# EAGLE schematic Maxim_7219_LED_display_Adafruit_0.56_7_segment_v1_1 (EAGLE 6.5.0)
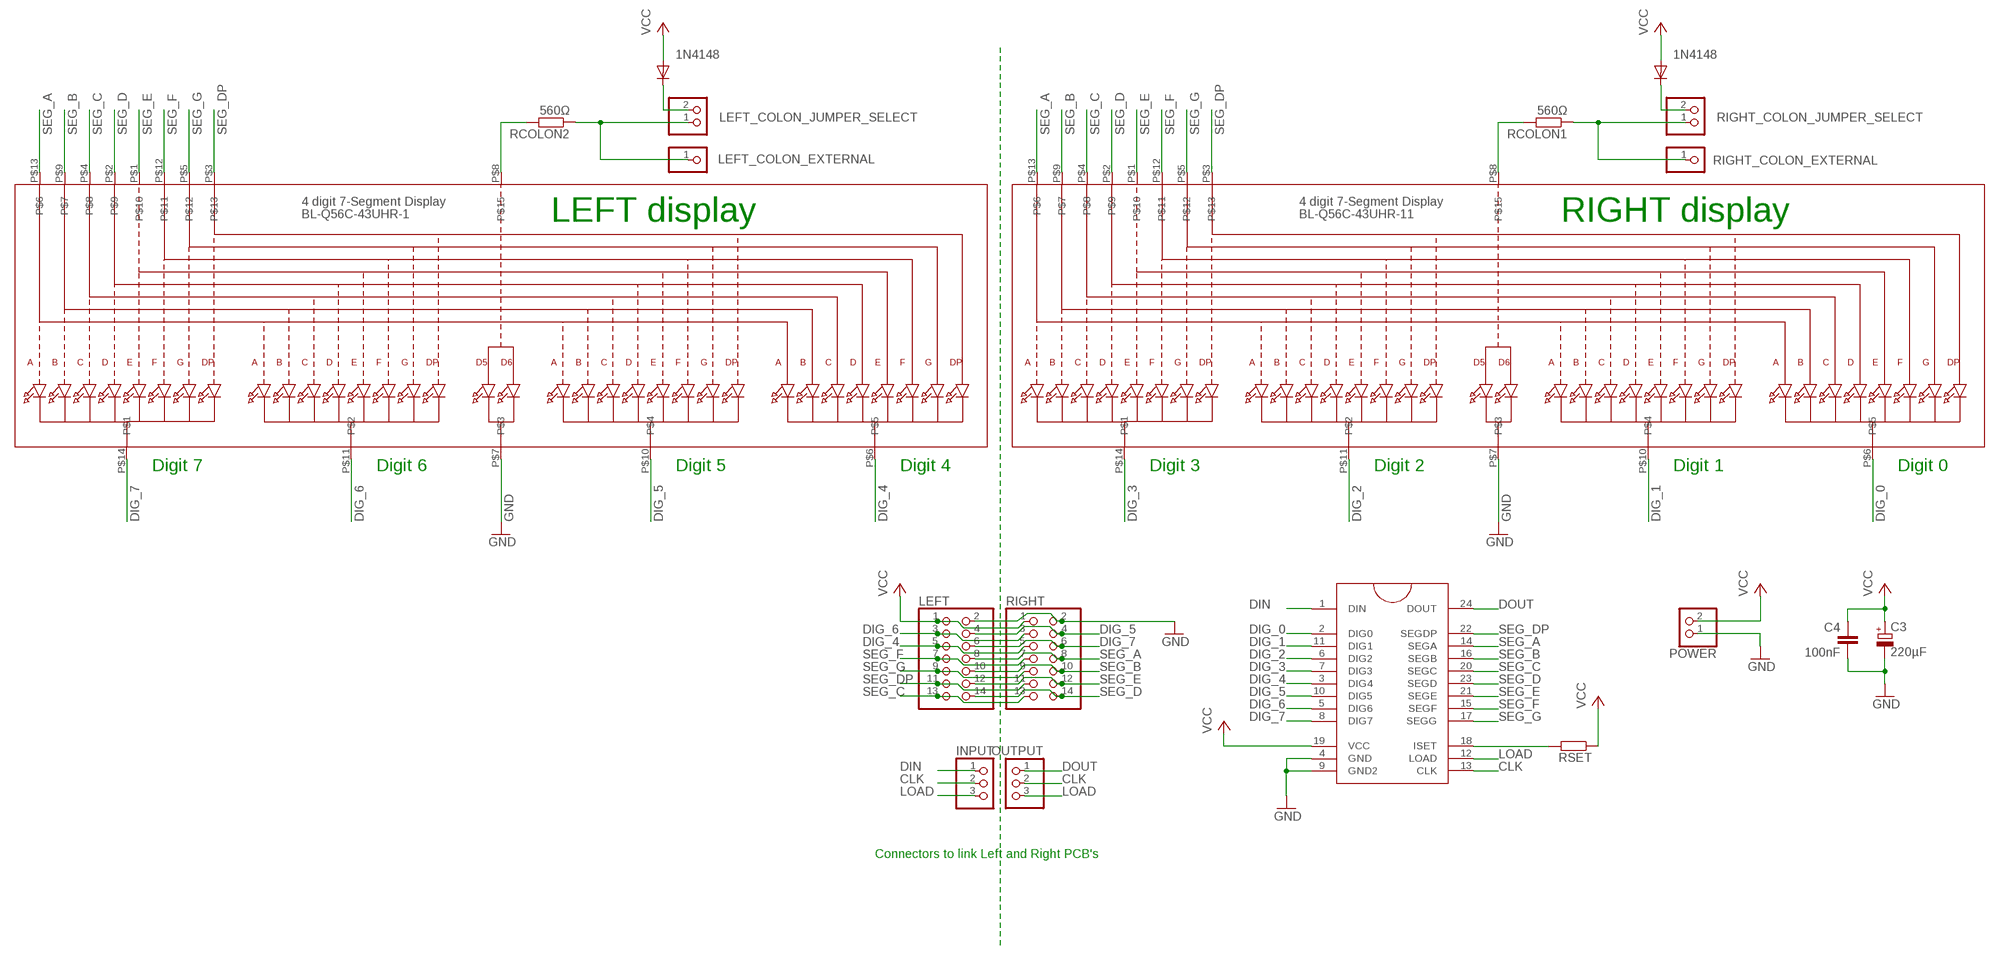
[diagram p0: schematic, sheet 1]

## Parts
BL-Q56C-43UHR-1  4 digit 7-Segment Display  DISP_SEGMENT_4DIGIT_BL-Q56C43  [SEGMENT-BL-Q56C43]
BL-Q56C-43UHR-11  4 digit 7-Segment Display  DISP_SEGMENT_4DIGIT_BL-Q56C43  [SEGMENT-BL-Q56C43]
C3  220µF  CPOL-EUE5-10.5  [E5-10,5]
C4  100nF  C-EU050-025X075  [C050-025X075]
D2  1N4148  1N4148DO35-7  [DO35-7]
D3  1N4148  1N4148DO35-7  [DO35-7]
INPUT  PINHD-1X3  [1X03]
LEFT  PINHD-2X7  [2X07]
LEFT_COLON_EXTERNAL  M01SMDNS  PINHD-1X1  [1X01]
LEFT_COLON_JUMPER_SELECT  PINHD-1X2  [1X02]
OUTPUT  PINHD-1X3  [1X03]
POWER  PINHD-1X2  [1X02]
RCOLON1  560Ω  R-EU_0207/10  [0207/10]
RCOLON2  560Ω  R-EU_0207/10  [0207/10]
RIGHT  PINHD-2X7  [2X07]
RIGHT_COLON_EXTERNAL  PINHD-1X1  [1X01]
RIGHT_COLON_JUMPER_SELECT  PINHD-1X2  [1X02]
RSET  R-EU_0207/2V  [0207/2V]
U$3  MAX7219DIP  [DIL24]

## Nets
CLK: INPUT.2 OUTPUT.2 U$3.13(CLK)
DIG_0: BL-Q56C-43UHR-11.P$6 U$3.2(DIG0)
DIG_1: BL-Q56C-43UHR-11.P$10 U$3.11(DIG1)
DIG_2: BL-Q56C-43UHR-11.P$11 U$3.6(DIG2)
DIG_3: BL-Q56C-43UHR-11.P$14 U$3.7(DIG3)
DIG_4: BL-Q56C-43UHR-1.P$6 LEFT.5 RIGHT.5 U$3.3(DIG4)
DIG_5: BL-Q56C-43UHR-1.P$10 LEFT.4 RIGHT.4 U$3.10(DIG5)
DIG_6: BL-Q56C-43UHR-1.P$11 LEFT.3 RIGHT.3 U$3.5(DIG6)
DIG_7: BL-Q56C-43UHR-1.P$14 LEFT.6 RIGHT.6 U$3.8(DIG7)
DIN: INPUT.1 U$3.1(DIN)
DOUT: OUTPUT.1 U$3.24(DOUT)
GND: BL-Q56C-43UHR-1.P$7 BL-Q56C-43UHR-11.P$7 C3.- C4.2 LEFT.2 POWER.1 RIGHT.2 U$3.4(GND) U$3.9(GND2)
LOAD: INPUT.3 OUTPUT.3 U$3.12(LOAD)
N$1: D2.C LEFT_COLON_JUMPER_SELECT.2
N$2: LEFT_COLON_EXTERNAL.1 LEFT_COLON_JUMPER_SELECT.1 RCOLON2.1
N$3: BL-Q56C-43UHR-1.P$8 RCOLON2.2
N$4: BL-Q56C-43UHR-11.P$8 RCOLON1.2
N$6: D3.C RIGHT_COLON_JUMPER_SELECT.2
N$7: RCOLON1.1 RIGHT_COLON_EXTERNAL.1 RIGHT_COLON_JUMPER_SELECT.1
N$9: RSET.2 U$3.18(ISET)
SEG_A: BL-Q56C-43UHR-1.P$13 BL-Q56C-43UHR-11.P$13 LEFT.8 RIGHT.8 U$3.14(SEGA)
SEG_B: BL-Q56C-43UHR-1.P$9 BL-Q56C-43UHR-11.P$9 LEFT.10 RIGHT.10 U$3.16(SEGB)
SEG_C: BL-Q56C-43UHR-1.P$4 BL-Q56C-43UHR-11.P$4 LEFT.13 RIGHT.13 U$3.20(SEGC)
SEG_D: BL-Q56C-43UHR-1.P$2 BL-Q56C-43UHR-11.P$2 LEFT.14 RIGHT.14 U$3.23(SEGD)
SEG_DP: BL-Q56C-43UHR-1.P$3 BL-Q56C-43UHR-11.P$3 LEFT.11 RIGHT.11 U$3.22(SEGDP)
SEG_E: BL-Q56C-43UHR-1.P$1 BL-Q56C-43UHR-11.P$1 LEFT.12 RIGHT.12 U$3.21(SEGE)
SEG_F: BL-Q56C-43UHR-1.P$12 BL-Q56C-43UHR-11.P$12 LEFT.7 RIGHT.7 U$3.15(SEGF)
SEG_G: BL-Q56C-43UHR-1.P$5 BL-Q56C-43UHR-11.P$5 LEFT.9 RIGHT.9 U$3.17(SEGG)
VCC: C3.+ C4.1 D2.A D3.A LEFT.1 POWER.2 RIGHT.1 RSET.1 U$3.19(VCC)

## Notes on the sheet
- LEFT display | RIGHT display
- Digit 7 | Digit 6 | Digit 5 | Digit 4 | Digit 3 | Digit 2 | Digit 1 | Digit 0
- Connectors to link Left and Right PCB's

## Library data of the parts
BL-Q56C-43UHR-1 BL-Q56C-43UHR-11 = microbuilder:DISP_SEGMENT_4DIGIT_BL-Q56C43
C3 = rcl:CPOL-EU: POLARIZED CAPACITOR, European symbol
C4 = rcl:C-EU: CAPACITOR, European symbol
D2 D3 = diode:1N4148: DIODE high speed (Philips)
INPUT OUTPUT = pinhead:PINHD-1X3: PIN HEADER
LEFT RIGHT = pinhead:PINHD-2X7: PIN HEADER
LEFT_COLON_EXTERNAL RIGHT_COLON_EXTERNAL = pinhead:PINHD-1X1: PIN HEADER
LEFT_COLON_JUMPER_SELECT POWER RIGHT_COLON_JUMPER_SELECT = pinhead:PINHD-1X2: PIN HEADER
RCOLON1 RCOLON2 RSET = rcl:R-EU_: RESISTOR, European symbol
U$3 = SparkFun-DigitalIC:MAX7219: 8-digit, 8-segment LED display driver, serial input